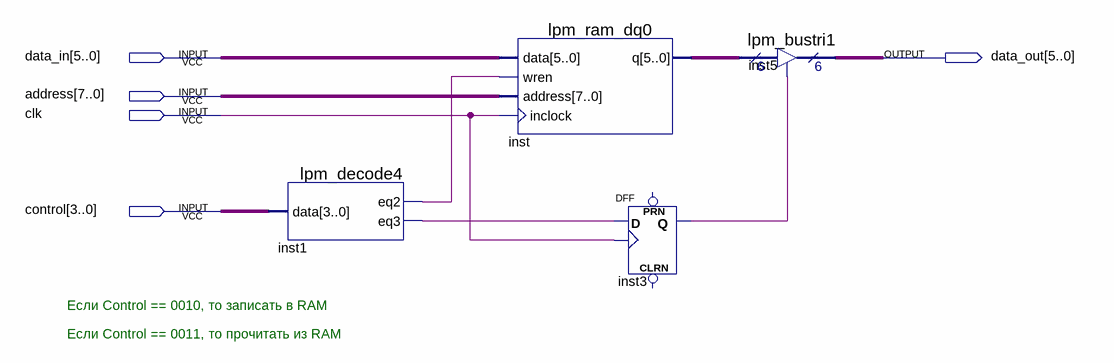
[diagram p0: schematic sheet]
// Quartus schematic data_memory_block.bdf as structural Verilog: 4 symbols, 5 pins
module data_memory_block (
  input  [5:0] data_in,
  input  [7:0] address,
  input  clk,
  input  [3:0] control,
  output [5:0] data_out
);

  wire inst1_eq2, inst1_eq3, inst3_q;
  wire [5:0] inst_q;

  lpm_decode4 inst1 (.data(control), .eq2(inst1_eq2), .eq3(inst1_eq3));
  lpm_ram_dq0 inst (.data(data_in), .wren(inst1_eq2), .address(address), .inclock(clk), .q(inst_q));
  DFF inst3 (.CLK(clk), .D(inst1_eq3), .Q(inst3_q));  // open: CLRN, PRN
  lpm_bustri1 inst5 (.enabledt(inst3_q), .data(inst_q), .tridata(data_out));

  // Notes on the sheet:
  //   Если Control == 0010, то записать в RAM
  //   Если Control == 0011, то прочитать из RAM
endmodule
